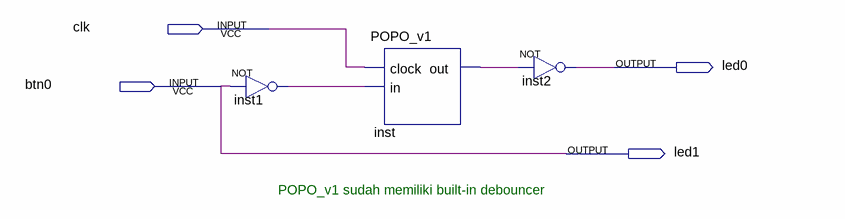
[diagram p0: schematic sheet]
// Quartus schematic test_POPO.bdf as structural Verilog: 3 symbols, 4 pins
module test_POPO (
  input  clk,
  input  btn0,
  output led0,
  output led1
);

  wire inst1_out, inst_out;

  not inst1 (inst1_out, btn0);
  POPO_v1 inst (.clock(clk), .in(inst1_out), .out(inst_out));
  not inst2 (led0, inst_out);

  assign led1 = btn0;

  // Notes on the sheet:
  //   POPO_v1 sudah memiliki built-in debouncer
endmodule
